# Altium schematic sheet 2_MCU.SchDoc
size A; SheetNumber: 3; SheetTotal: 4
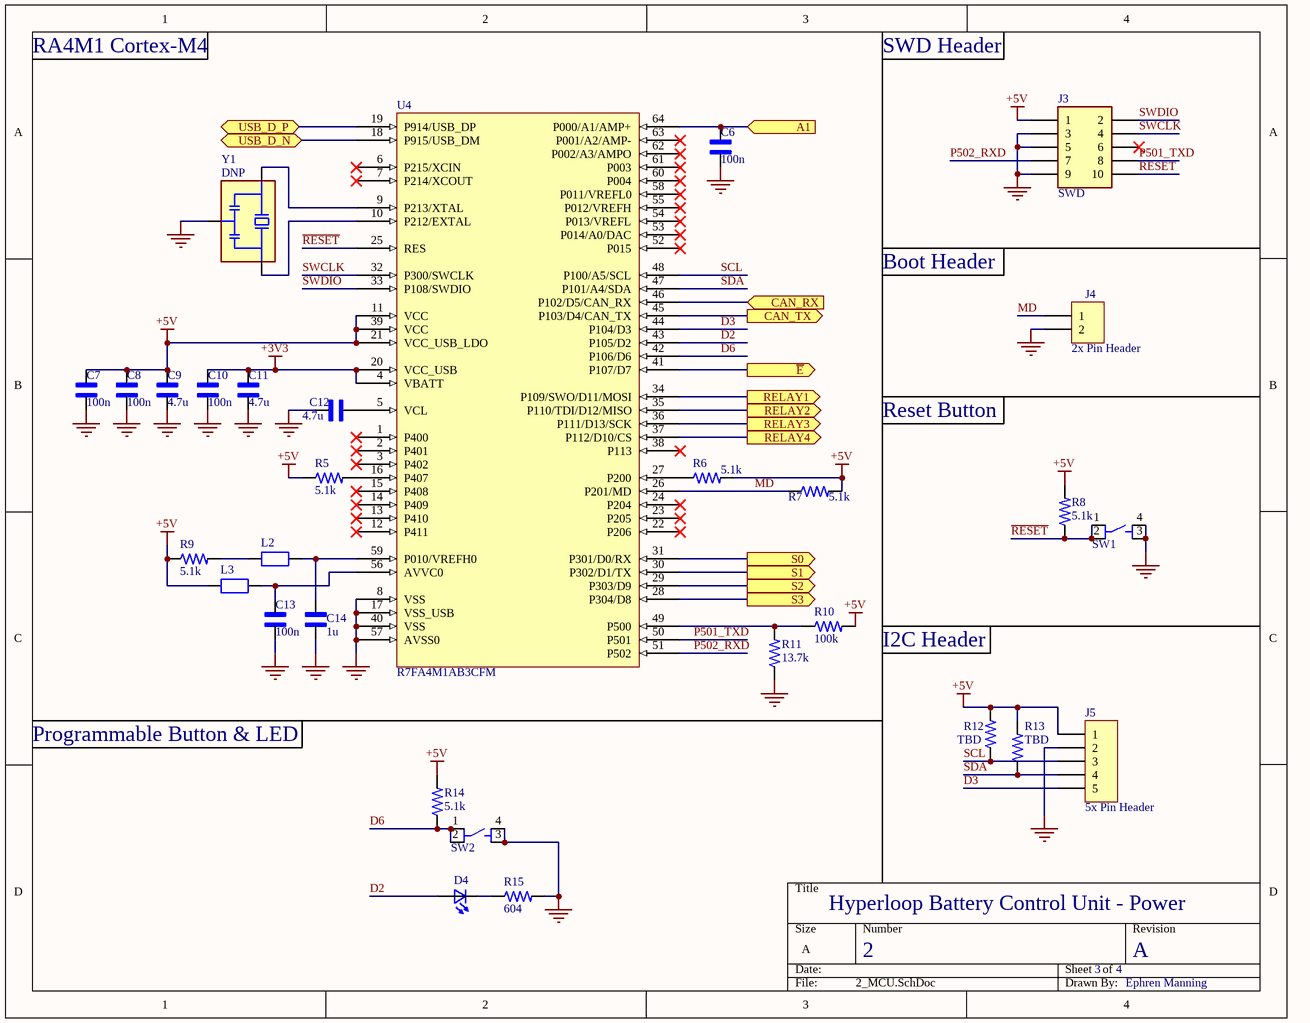
[diagram p0: 2_MCU.SchDoc]

## Parts
C6  100n  [CAP_0603-Footprint]
C7  100n  [CAP_0603-Footprint]
C8  100n  [CAP_0603-Footprint]
C9  4.7u  [CAP_0603-Footprint]
C10  100n  [CAP_0603-Footprint]
C11  4.7u  [CAP_0603-Footprint]
C12  4.7u  [CAP_0603-Footprint]
C13  100n  [CAP_0603-Footprint]
C14  1u  [CAP_0603-Footprint]
D4  LTST-C191KGKT  [LED_0603-Footprint-1]  (value not drawn)
J3  SWD  [CNC_3221-10-0100-00]
J4  2x Pin Header  [2x Pin Header-Footprint-1]
J5  5x Pin Header  [5x Pin Header-Footprint-1]
L2  BLM18PG471SN1D  [BEADC1608X95N]  (value not drawn)
L3  BLM18PG471SN1D  [BEADC1608X95N]  (value not drawn)
R5  5.1k  [RES_0603-Footprint-1]
R6  5.1k  [RES_0603-Footprint-1]
R7  5.1k  [RES_0603-Footprint-1]
R8  5.1k  [RES_0603-Footprint-1]
R9  5.1k  [RES_0603-Footprint-1]
R10  100k  [RES_0603-Footprint-1]
R11  13.7k  [RES_0603-Footprint-1]
R12  TBD  [RES_0603-Footprint-1]
R13  TBD  [RES_0603-Footprint-1]
R14  5.1k  [RES_0603-Footprint-1]
R15  604  [RES_0603-Footprint-1]
SW1  PTS810_SJM_250_SMTR_LFS  [SW_PTS810_SJM_250_SMTR_LFS]  (value not drawn)
SW2  PTS810_SJM_250_SMTR_LFS  [SW_PTS810_SJM_250_SMTR_LFS]  (value not drawn)
U4  R7FA4M1AB3CFM  [R7FA4M1AB3CFM-Footprint-1]
Y1  DNP  [OSC_CSTNE12M0G55Z000R0]

## Ports
A1 (in, see 0_Overview[3B], 3_Peripherals[2C]), CAN_RX (in, see 0_Overview[3C], 3_Peripherals[2A]), CAN_TX (out, see 0_Overview[3C], 3_Peripherals[2A]), RELAY1 (out, see 0_Overview[3C], 3_Peripherals[1A]), RELAY2 (out, see 0_Overview[3C], 3_Peripherals[1B]), RELAY3 (out, see 0_Overview[3C], 3_Peripherals[1C]), RELAY4 (out, see 0_Overview[3C], 3_Peripherals[1D]), S0 (out, see 0_Overview[3B], 3_Peripherals[2C]), S1 (out, see 0_Overview[3B], 3_Peripherals[2C]), S2 (out, see 0_Overview[3B], 3_Peripherals[2C]), S3 (out, see 0_Overview[3B], 3_Peripherals[2C]), USB_D_N (bidir, see 0_Overview[2B], 1_Power[2C]), USB_D_P (bidir, see 0_Overview[2B], 1_Power[2C]), ~{E} (out, see 0_Overview[3B], 3_Peripherals[2C])

## Nets
+3V3: C10.2 C11.2 U4.4(VBATT) U4.20(VCC_USB)
+5V: C7.2 C8.2 C9.2 J3.1 J5.1 L3.1 R5.1 R6.2 R7.2 R8.2 R9.1 R10.2 R12.2 R13.2 R14.2 U4.11(VCC) U4.21(VCC_USB_LDO) U4.39(VCC)
GND: C6.1 C7.1 C8.1 C9.1 C10.1 C11.1 C12.1 C13.1 C14.1 J3.3 J3.5 J3.9 J4.2 J5.2 R11.1 R15.2 SW1.3 SW1.4 SW2.3 SW2.4 U4.8(VSS) U4.17(VSS_USB) U4.40(VSS) U4.57(AVSS0) Y1.2(GND)
A1: C6.2 U4.64(P000/A1/AMP+) ; port A1
CAN_RX: U4.46(P102/D5/CAN_RX) ; port CAN_RX
CAN_TX: U4.45(P103/D4/CAN_TX) ; port CAN_TX
D2: D4.2(A2) U4.43(P105/D2)
D3: J5.5 U4.44(P104/D3)
D6: R14.1 SW2.1 SW2.2 U4.42(P106/D6)
~{E}: U4.41(P107/D7) ; port ~{E}
MD: J4.1 R7.1 U4.26(P201/MD)
P501_TXD: J3.8 U4.50(P501)
P502_RXD: J3.7 U4.51(P502)
~{RESET}: J3.10 R8.1 SW1.1 SW1.2 U4.25(RES)
RELAY1: U4.34(P109/SWO/D11/MOSI) ; port RELAY1
RELAY2: U4.35(P110/TDI/D12/MISO) ; port RELAY2
RELAY3: U4.36(P111/D13/SCK) ; port RELAY3
RELAY4: U4.37(P112/D10/CS) ; port RELAY4
S0: U4.31(P301/D0/RX) ; port S0
S1: U4.30(P302/D1/TX) ; port S1
S2: U4.29(P303/D9) ; port S2
S3: U4.28(P304/D8) ; port S3
SCL: J5.3 R12.1 U4.48(P100/A5/SCL)
SDA: J5.4 R13.1 U4.47(P101/A4/SDA)
SWCLK: J3.4 U4.32(P300/SWCLK)
SWDIO: J3.2 U4.33(P108/SWDIO)
USB_D_N: U4.18(P915/USB_DM) ; port USB_D_N
USB_D_P: U4.19(P914/USB_DP) ; port USB_D_P
NetC12_2: C12.2 U4.5(VCL)
NetC13_2: C13.2 L3.2 U4.56(AVVC0)
NetC14_2: C14.2 L2.2 U4.59(P010/VREFH0)
NetD4_1: D4.1(K2) R15.1
NetL2_1: L2.1 R9.2
NetR5_2: R5.2 U4.16(P407)
NetR6_1: R6.1 U4.27(P200)
NetR10_1: R10.1 R11.2 U4.49(P500)
NetU4_9: U4.9(P213/XTAL) Y1.1(IN)
NetU4_10: U4.10(P212/EXTAL) Y1.3(OUT)

Not connected (* = marked no-connect by the designer): J3 6*; U4 1(P400)* 2(P401)* 3(P402)* 6(P215/XCIN)* 7(P214/XCOUT)* 12(P411)* 13(P410)* 14(P409)* 15(P408)* 22(P206)* 23(P205)* 24(P204)* 38(P113)* 52(P015)* 53(P014/A0/DAC)* 54(P013/VREFL)* 55(P012/VREFH)* 58(P011/VREFL0)* 60(P004)* 61(P003)* 62(P002/A3/AMPO)* 63(P001/A2/AMP-)*

## Notes on the sheet
- RA4M1 Cortex-M4
- SWD Header
- Boot Header
- Reset Button
- (near R10) I2C Header
- Programmable Button & LED
- Hyperloop Battery Control Unit - Power
- 2
- 3
- 4
- A
- Ephren Manning

## Library data of the parts
C6-C8 C10 C13 = CMP-00029-2: 100nF/16V ±10% Ceramic 0603; Manufacturer Part Number 1: CL10B104KO8NNNC; Manufacturer 1: Samsung Electro-Mechanics
C9 C11 C12 = CMP-00032-1: 4.7uF/10V 0603 Ceramic Capacitor; Manufacturer 1: Samsung Electro-Mechanics; Manufacturer Part Number 1: CL10A475KP8NNNC
C14 = CMP-026-000000-4: 1uF/10V ±10% 0603; Manufacturer Part Number 1: CL10B105KP8NNNC; Manufacturer 1: Samsung Electro-Mechanics
D4 = CMP-038-000000-5: Green 571nm LED Indication - Discrete 2V 0603 (1608 Metric); Manufacturer 1: Lite-On Inc.; Manufacturer Part Number 1: LTST-C191KGKT
J3 = CMP-012-000000-3: SWD Connector; Manufacturer 1: CNC Tech; Manufacturer Part Number 1: 3221-10-0100-00
J4 = CMP-00012-3
J5 = CMP-00034-2
L2 L3 = CMP-024-000000-4: Ferrite Bead, 0603, 470 Ohms @ 100MHz; Manufacturer 1: Murata; Manufacturer Part Number 1: BLM18PG471SN1D
R5-R9 R12-R14 = CMP-028-000000-5: 5.1k Ohms ±1% 0.1W 0603; Manufacturer Part Number 1: RC0603FR-075K1L; Manufacturer 1: Yageo
R10 = CMP-030-000000-4: 100k ±1% 0.1W, 0603; Manufacturer Part Number 1: RC0603FR-07100KL; Manufacturer 1: Yageo
R11 = CMP-032-000000-3: 13.7K 1% 0,1W 0603; Manufacturer 1: YAGEO; Manufacturer Part Number 1: RC0603FR-0713K7L
R15 = CMP-00040-1: 604 Ohm 1% 1/10 W 0603; Manufacturer Part Number 1: RC0603FR-07604RL; Manufacturer 1: YAGEO
SW1 SW2 = CMP-014-000000-3: Tactile Switch SPST-NO Top Actuated Surface Mount; Manufacturer 1: C&K; Manufacturer Part Number 1: PTS810 SJM 250 SMTR LFS
U4 = CMP-00000-7: RA4M1 Cortex-M4 Microcontroller 64-LQFP; Manufacturer Part Number 1: R7FA4M1AB3CFM#AA0; Manufacturer 1: Renesas
Y1 = CMP-072-000000-4: 12MHz Ceramic Resonator Built in Capacitor 33pF ±0.2% 30 Ohms Surface Mount; Manufacturer 1: Murata Electronics; Manufacturer Part Number 1: CSTNE12M0G55Z000R0